# EAGLE schematic crossroad (EAGLE 7.3.0)
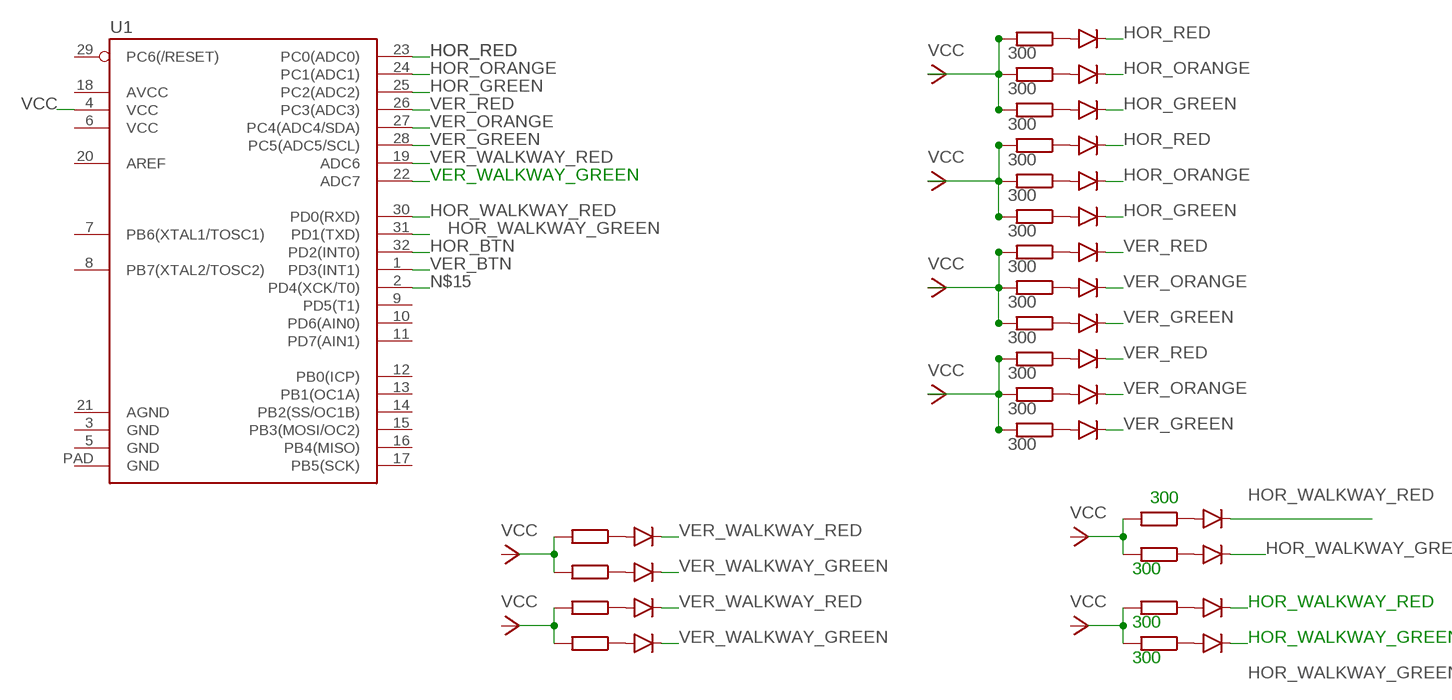
[diagram p0: schematic, sheet 1]

## Parts
D1  orange  DIODE1N4148  [DIODE-1N4148]
D2  green  DIODE1N4148  [DIODE-1N4148]
D3  red  DIODE1N4148  [DIODE-1N4148]
D4  orange  DIODE1N4148  [DIODE-1N4148]
D5  green  DIODE1N4148  [DIODE-1N4148]
D6  red  DIODE1N4148  [DIODE-1N4148]
D7  orange  DIODE1N4148  [DIODE-1N4148]
D8  green  DIODE1N4148  [DIODE-1N4148]
D9  red  DIODE1N4148  [DIODE-1N4148]
D10  orange  DIODE1N4148  [DIODE-1N4148]
D11  green  DIODE1N4148  [DIODE-1N4148]
D12  red  DIODE1N4148  [DIODE-1N4148]
D13  red  DIODE1N4148  [DIODE-1N4148]
D14  orange  DIODE1N4148  [DIODE-1N4148]
D15  red  DIODE1N4148  [DIODE-1N4148]
D16  orange  DIODE1N4148  [DIODE-1N4148]
D17  red  DIODE1N4148  [DIODE-1N4148]
D18  orange  DIODE1N4148  [DIODE-1N4148]
D19  red  DIODE1N4148  [DIODE-1N4148]
D20  orange  DIODE1N4148  [DIODE-1N4148]
R1  300  SMK  [SMK]
R2  300  SMK  [SMK]
R3  300  SMK  [SMK]
R4  300  SMK  [SMK]
R5  300  SMK  [SMK]
R6  300  SMK  [SMK]
R7  300  SMK  [SMK]
R8  300  SMK  [SMK]
R9  300  SMK  [SMK]
R10  300  SMK  [SMK]
R11  300  SMK  [SMK]
R12  300  SMK  [SMK]
R13  300  SMK  [SMK]
R14  300  SMK  [SMK]
R15  300  SMK  [SMK]
R16  300  SMK  [SMK]
R17  300  SMK  [SMK]
R18  300  SMK  [SMK]
R19  300  SMK  [SMK]
R20  300  SMK  [SMK]
U1  ATMEGA328P_MLFMLF32  [MLF32-PAD]

## Nets
HOR_BTN: U1.32(PD2(INT0))
HOR_GREEN: D2.C D5.C U1.25(PC2(ADC2))
HOR_ORANGE: D1.C D4.C U1.24(PC1(ADC1))
HOR_RED: D3.C D6.C U1.23(PC0(ADC0))
HOR_WALKWAY_GREEN: D14.C D16.C U1.31(PD1(TXD))
HOR_WALKWAY_RED: D13.C D15.C U1.30(PD0(RXD))
N$1: D3.A R1.1
N$2: D1.A R2.1
N$3: D2.A R3.1
N$4: D6.A R4.1
N$5: D4.A R5.1
N$6: D5.A R6.1
N$7: D9.A R7.1
N$8: D7.A R8.1
N$9: D8.A R9.1
N$10: D12.A R10.1
N$11: D10.A R11.1
N$12: D11.A R12.1
N$13: D13.A R13.1
N$14: D14.A R14.1
N$15: U1.2(PD4(XCK/T0))
N$16: R13.2 R14.2
N$17: D15.A R15.1
N$18: D16.A R16.1
N$19: R15.2 R16.2
N$20: D17.A R17.1
N$21: D18.A R18.1
N$22: R17.2 R18.2
N$23: D19.A R19.1
N$24: D20.A R20.1
N$25: R19.2 R20.2
VCC: R1.2 R2.2 R3.2 R4.2 R5.2 R6.2 R7.2 R8.2 R9.2 R10.2 R11.2 R12.2 U1.4(VCC)
VER_BTN: U1.1(PD3(INT1))
VER_GREEN: D8.C D11.C U1.28(PC5(ADC5/SCL))
VER_ORANGE: D7.C D10.C U1.27(PC4(ADC4/SDA))
VER_RED: D9.C D12.C U1.26(PC3(ADC3))
VER_WALKWAY_GREEN: D18.C D20.C U1.22(ADC7)
VER_WALKWAY_RED: D17.C D19.C U1.19(ADC6)
Unconnected: U1.3(GND) U1.5(GND) U1.6(VCC) U1.7(PB6(XTAL1/TOSC1)) U1.8(PB7(XTAL2/TOSC2)) U1.9(PD5(T1)) U1.10(PD6(AIN0)) U1.11(PD7(AIN1)) U1.12(PB0(ICP)) U1.13(PB1(OC1A)) U1.14(PB2(SS/OC1B)) U1.15(PB3(MOSI/OC2)) U1.16(PB4(MISO)) U1.17(PB5(SCK)) U1.18(AVCC) U1.20(AREF) U1.21(AGND) U1.29(PC6(/RESET)) U1.PAD(GND)

## Library data of the parts
D1-D20 = SparkFun-DiscreteSemi:DIODE: Diode These are standard reverse protection diodes and small signal diodes. SMA package can handle up to about 1A. SOD-323 can handle about 200mA. What the SOD-323 package when ordering, there are some mfgs out there that are 5-pin packages.
R1-R20 = resistor-shunt:SMK: SMD SHUNT RESISTOR; OC_FARNELL: unknown; OC_NEWARK: unknown
U1 = SparkFun-DigitalIC:ATMEGA328P_MLF: 32-Pin Atmega328 part Commonly used on Arduino compatible boards Available in QFP and QFN packages TQFP is IC-09069 QFN is non-stock